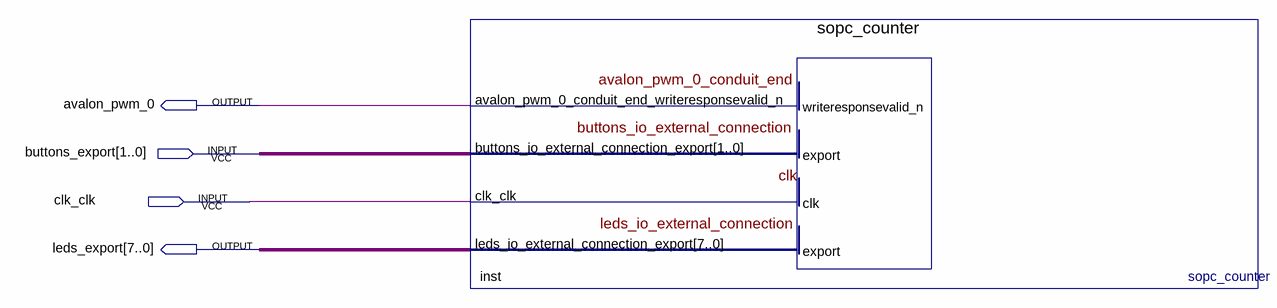
[diagram p0: schematic sheet]
// Quartus schematic sopc_counters.bdf as structural Verilog: 1 symbols, 4 pins
module sopc_counters (
  input  [1:0] buttons_export,
  input  clk_clk,
  output avalon_pwm_0,
  output [7:0] leds_export
);

  sopc_counter inst (
    .buttons_io_external_connection_export(buttons_export), .clk_clk(clk_clk),
    .avalon_pwm_0_conduit_end_writeresponsevalid_n(avalon_pwm_0),
    .leds_io_external_connection_export(leds_export));
endmodule
